# EasyEDA schematic SCH_5G23运算放大器_2022-10-08.json
TITLE: 5G23; REV: 1.0; Date: 2022-04-18; Sheet: 1/1; Drawn By: BH2VGM; Company: NEU-ISE
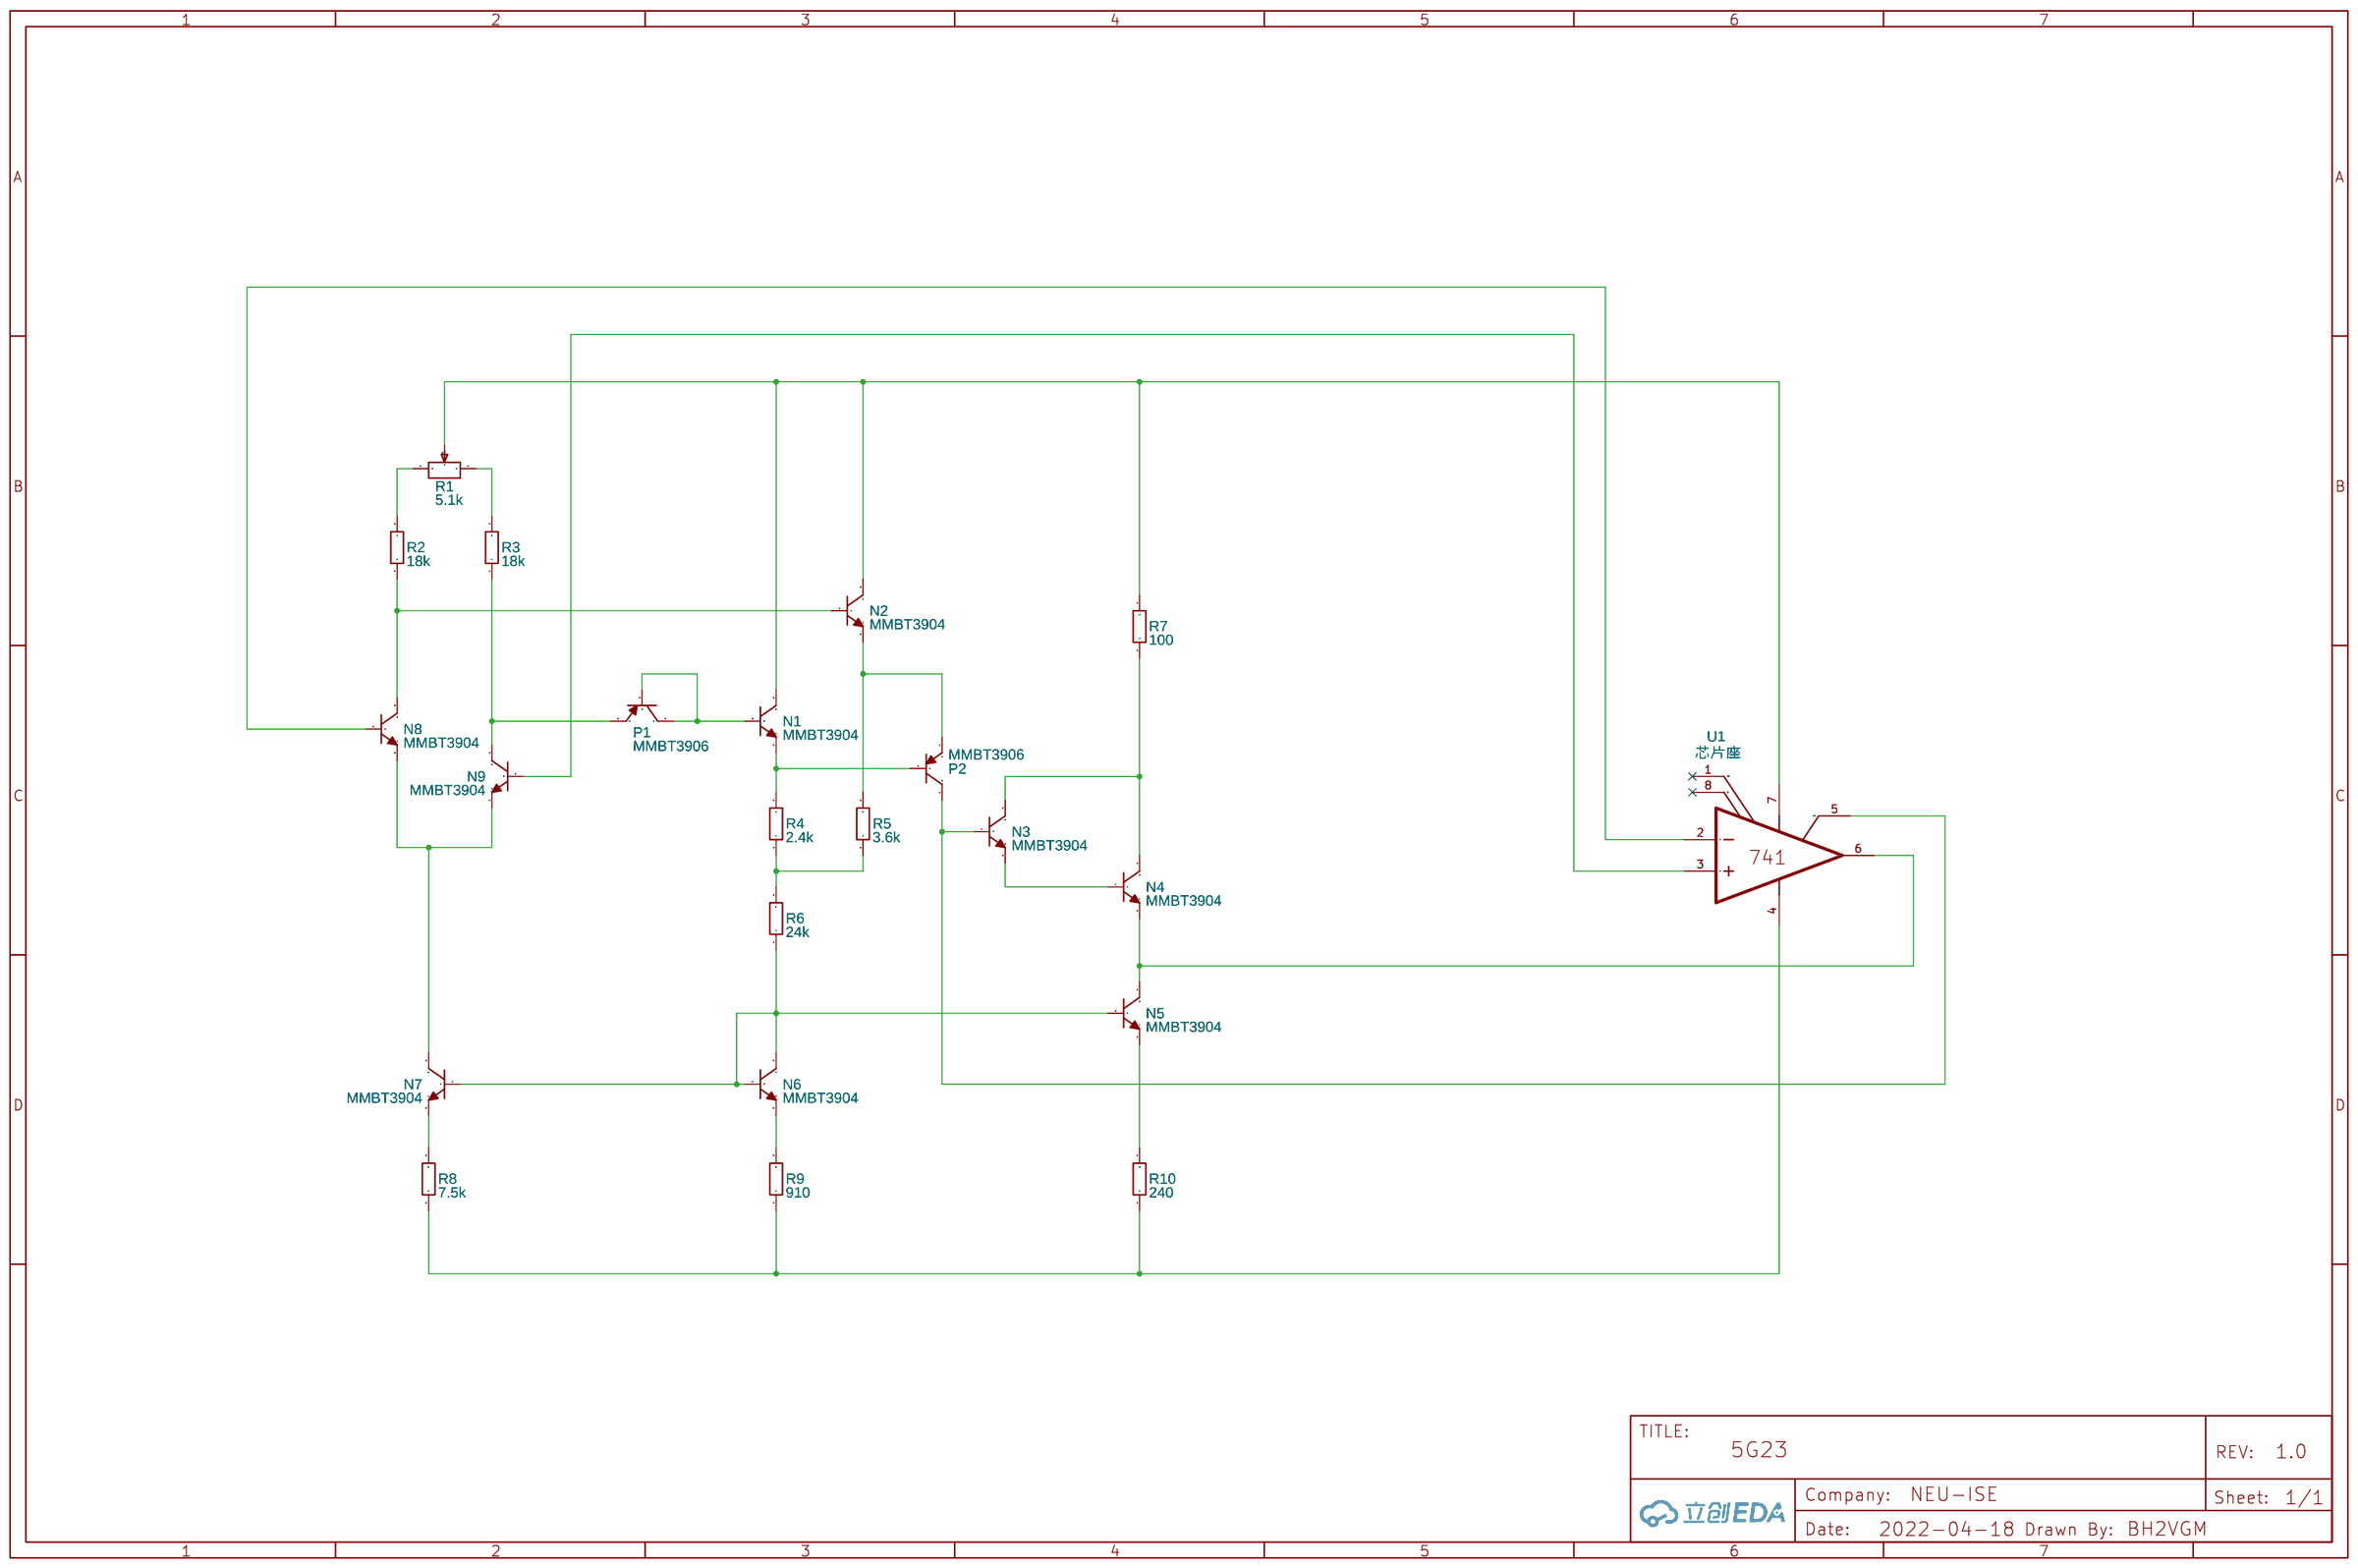
[diagram p0: schematic sheet]

## Parts
N1  MMBT3904  [SOT-23-3_L2.9-W1.3-P1.90-LS2.4-BR]
N2  MMBT3904  [SOT-23-3_L2.9-W1.3-P1.90-LS2.4-BR]
N3  MMBT3904  [SOT-23-3_L2.9-W1.3-P1.90-LS2.4-BR]
N4  MMBT3904  [SOT-23-3_L2.9-W1.3-P1.90-LS2.4-BR]
N5  MMBT3904  [SOT-23-3_L2.9-W1.3-P1.90-LS2.4-BR]
N6  MMBT3904  [SOT-23-3_L2.9-W1.3-P1.90-LS2.4-BR]
N7  MMBT3904  [SOT-23-3_L2.9-W1.3-P1.90-LS2.4-BR]
N8  MMBT3904  [SOT-23-3_L2.9-W1.3-P1.90-LS2.4-BR]
N9  MMBT3904  [SOT-23-3_L2.9-W1.3-P1.90-LS2.4-BR]
P1  MMBT3906  [SOT-23-3_L2.9-W1.3-P1.90-LS2.4-TR-2]
P2  MMBT3906  [SOT-23-3_L2.9-W1.3-P1.90-LS2.4-TR-2]
R1  5.1k  [RES-ADJ-SMD_VG039NCH]
R2  18k  [R0805]
R3  18k  [R0805]
R4  2.4k  [R0805]
R5  3.6k  [R0805]
R6  24k  [R0805]
R7  100  [R0805]
R8  7.5k  [R0805]
R9  910  [R0805]
R10  240  [R0805]
U1  芯片座  [DIP8]

## Library data of the parts
N1-N9 = MMBT3904-C20526: Supplier: LCSC; Manufacturer: CJ; Supplier Part: C20526; Contributor: 立创EDA官方封装库; JLCPCB Part Class: Basic Part
P1 P2 = MMBT3906G-AE3-R: Supplier: LCSC; Manufacturer: UTC; Supplier Part: C87445; JLCPCB Part Class: Extended Part
R1 = VG039NCHXTB204: Supplier: LCSC; Manufacturer: HDK; Supplier Part: C128551; Resistance(Ohms): 200K; Resistance (Ohms): 200K; JLCPCB Part Class: Extended Part
R2-R10 = 0805: Supplier: LCSC; Supplier Part: C9900012715; Manufacturer: null; link: https://atta.szlcsc.comnull; Contributor: LCSC; JLCPCB Part Class: Extended Part
U1 = UA741CP: Supplier: LCSC; Supplier Part: C2057458; Manufacturer: TI(德州仪器); Manufacturer Part: UA741CDR; Contributor: king13478509115

## Nets
Net-(N1-1): N1.1(B) P1.2(B) P1.3(C)
Net-(N1-2): N1.2(E) P2.2(B) R4.2
Net-(N1-3): N1.3(C) N2.3(C) R1.2 R7.2 U1.7(VCC+)
Net-(N2-1): N2.1(B) N8.3(C) R2.1
Net-(N2-2): N2.2(E) P2.1(E) R5.2
Net-(N3-1): N3.1(B) P2.3(C) U1.5(OFFSET N2)
Net-(N3-2): N3.2(E) N4.1(B)
Net-(N3-3): N3.3(C) N4.3(C) R7.1
Net-(N4-2): N4.2(E) N5.3(C) U1.6(OUT)
Net-(N5-1): N5.1(B) N6.1(B) N6.3(C) N7.1(B) R6.1
Net-(N5-2): N5.2(E) R10.2
Net-(N6-2): N6.2(E) R9.2
Net-(N7-2): N7.2(E) R8.2
Net-(N7-3): N7.3(C) N8.2(E) N9.2(E)
Net-(N8-1): N8.1(B) U1.2(-IN)
Net-(N9-1): N9.1(B) U1.3(+IN)
Net-(N9-3): N9.3(C) P1.1(E) R3.1
Net-(R1-1): R1.1 R2.2
Net-(R1-3): R1.3 R3.2
Net-(R4-1): R4.1 R5.1 R6.2
Net-(R8-1): R8.1 R9.1 R10.1 U1.4(VCC-)

Not connected (* = marked no-connect by the designer): U1 1(OFFSET N1)* 8(NC)*
